# EAGLE design Fan Controller v1.0 (EAGLE 6.4)
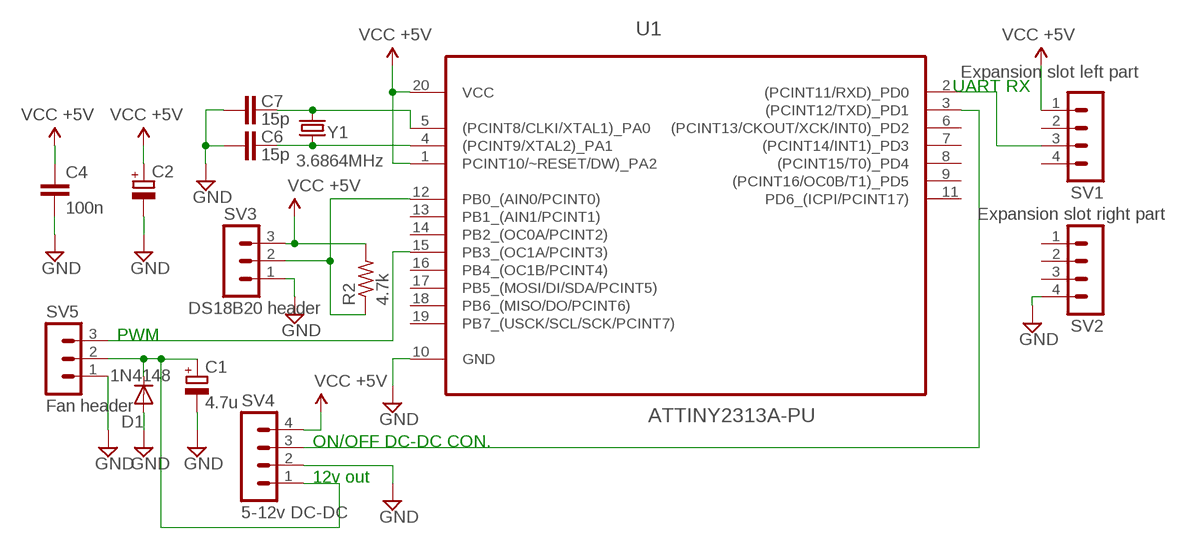
[diagram p0: schematic, sheet 1]

## Parts
C1  4.7u  CPOL-EUE2,5-6E  [E2,5-6E]
C2  CPOL-EUE5-6  [E5-6]
C4  100n  C-EUC0805K  [C0805K]
C6  15p  C-EUC0805K  [C0805K]
C7  15p  C-EUC0805K  [C0805K]
D1  1N4148  1N4148DO35-7  [DO35-7]
R2  4.7k  R-US_R1206  [R1206]
SV1  Expansion slot left part  MA04-1  [MA04-1]
SV2  Expansion slot right part  MA04-1  [MA04-1]
SV3  DS18B20 header  MA03-1  [MA03-1]
SV4  5-12v DC-DC  MA04-1  [MA04-1]
SV5  Fan header  MA03-1  [MA03-1]
U1  ATTINY2313A-PU  [DIP254P762X533-20]
Y1  3.6864MHz  CRYSTALHC49UV  [HC49U-V]

## Nets
12VOUT: C1.+ D1.C SV4.1 SV5.2
GND: C1.- C2.- C4.2 C6.2 C7.2 D1.A SV2.4 SV3.1 SV4.2 SV5.1 U1.10(GND)
N$1: SV1.3 U1.2((PCINT11/RXD)_PD0)
N$2: C7.1 U1.5((PCINT8/CLKI/XTAL1)_PA0) Y1.2
N$3: SV5.3 U1.15(PB3_(OC1A/PCINT3))
N$4: C6.1 U1.4((PCINT9/XTAL2)_PA1) Y1.1
N$5: R2.1 SV3.2 U1.12(PB0_(AIN0/PCINT0))
N$6: SV4.3 U1.3((PCINT12/TXD)_PD1)
VCC: C2.+ C4.1 R2.2 SV1.1 SV3.3 SV4.4 U1.1(PCINT10/~RESET/DW)_PA2) U1.20(VCC) ; supply symbol labelled VCC +5V
Unconnected: SV1.2 SV1.4 SV2.1 SV2.2 SV2.3 U1.6((PCINT13/CKOUT/XCK/INT0)_PD2) U1.7((PCINT14/INT1)_PD3) U1.8((PCINT15/T0)_PD4) U1.9((PCINT16/OC0B/T1)_PD5) U1.11(PD6_(ICPI/PCINT17)) U1.13(PB1_(AIN1/PCINT1)) U1.14(PB2_(OC0A/PCINT2)) U1.16(PB4_(OC1B/PCINT4)) U1.17(PB5_(MOSI/DI/SDA/PCINT5)) U1.18(PB6_(MISO/DO/PCINT6)) U1.19(PB7_(USCK/SCL/SCK/PCINT7))

## Notes on the sheet
- UART RX
- PWM
- ON/OFF DC-DC CON.
- 12v out

## Library data of the parts
C1 C2 = rcl:CPOL-EU: POLARIZED CAPACITOR, European symbol
C4 C6 C7 = rcl:C-EU: CAPACITOR, European symbol
D1 = diode:1N4148: DIODE high speed (Philips)
R2 = rcl:R-US_: RESISTOR, American symbol
SV1 SV2 SV4 = con-lstb:MA04-1: PIN HEADER; OC_FARNELL: unknown; OC_NEWARK: unknown
SV3 SV5 = con-lstb:MA03-1: PIN HEADER; OC_FARNELL: unknown; OC_NEWARK: unknown
U1 = Atmel_By_element14_Batch_1-00:ATTINY2313A-PU: 8-bit Microcontroller; DESCRIPTION: 8-bit Microcontroller; MPN: ATTINY2313A-PU; OC_FARNELL: 1841616; OC_NEWARK: 12T1333; PACKAGE: DIP-20; SUPPLIER: Atmel
Y1 = SteveMarple:CRYSTAL: Crystals Various standard crystals. Proven footprints. Spark Fun Electronics SKU : COM-00534

## Board
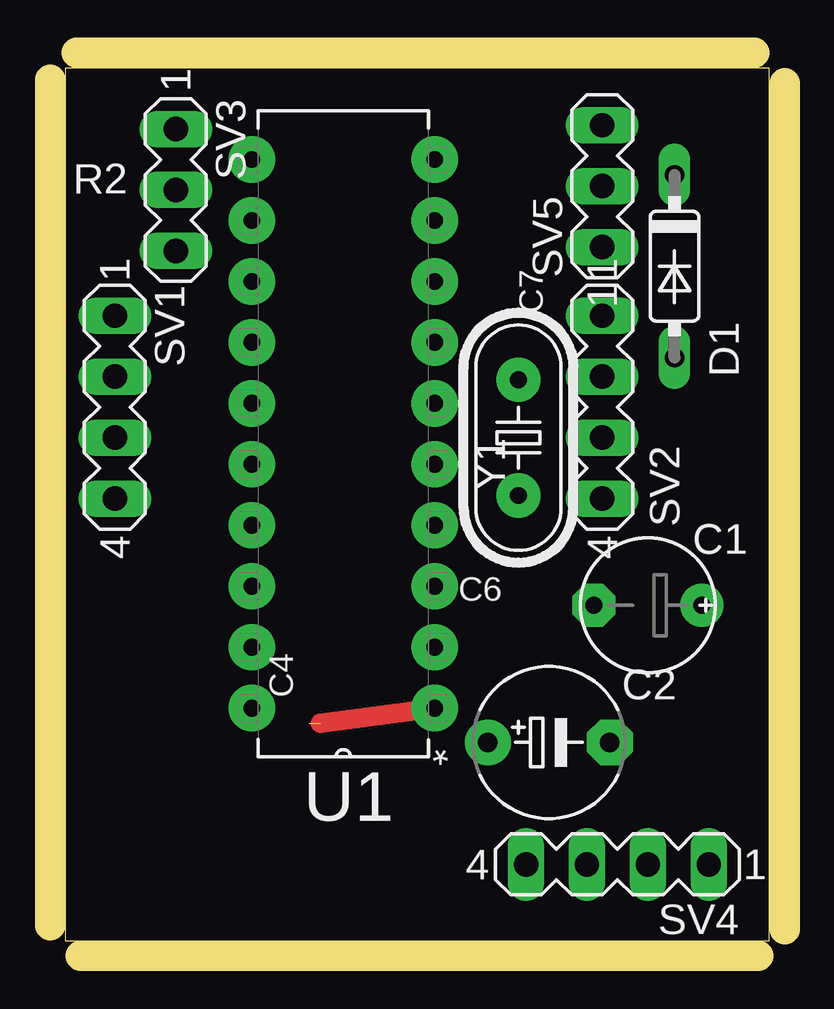
[diagram p1: board, top side]
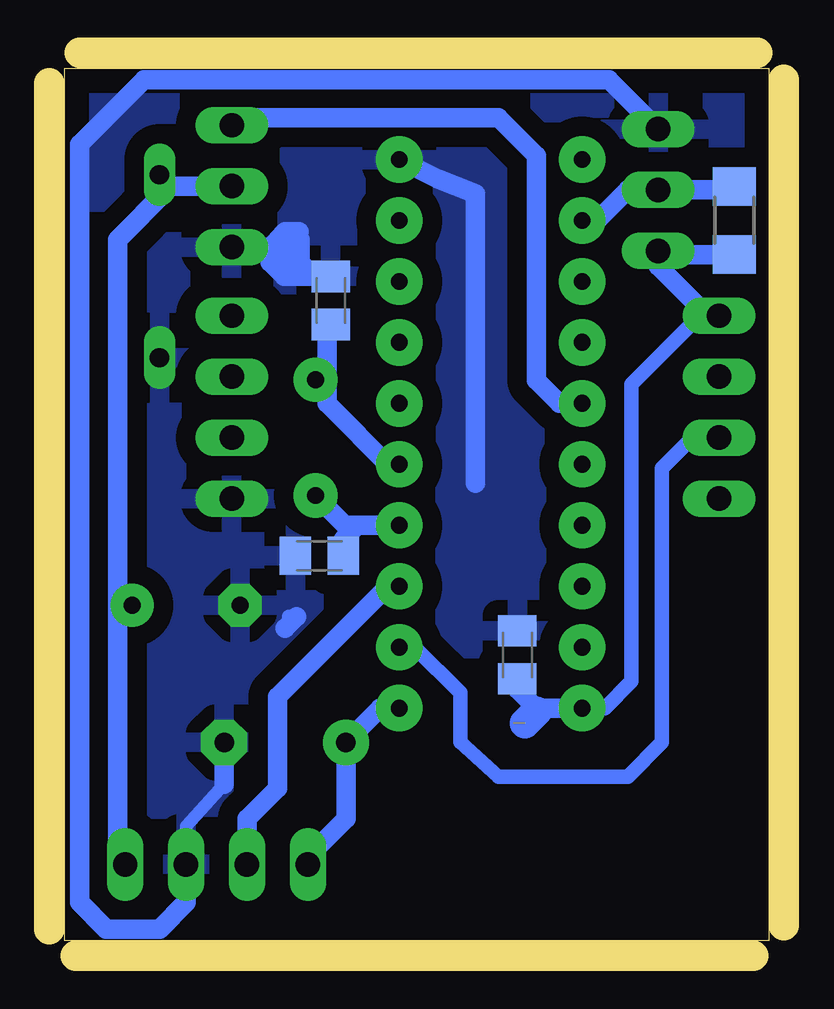
[diagram p2: board, bottom side, seen from below]

Size 29.35 x 36.34 mm. Coordinates in mm from the lower left corner, seen from the top.
Outline: 0,0 29.35,0 29.35,36.34 0,36.34 0,0
Copper layers (1*16): Top 0.035mm / dielectric 1.5mm / Bottom 0.035mm
Design rules "default *": minimum track width 10mil, minimum drill 24mil, track to track 8mil, track to pad 8mil, pad to pad 8mil, via to via 8mil, smd to smd 8mil, copper to edge 40mil, drill to drill 8mil, minimum pad ring 10mil, minimum via ring 8mil, stop-mask expansion 4mil, vias tented up to drill 0mil, thermal gap 25mil
Milling: 4 lines

### Footprints (pad centres in the part's own frame; a part is rotated, then mirrored left to right if it is on the bottom)
E2,5-6E = drill 0.7 pad 1.778: + -2.25,0 | drill 0.7 pad 1.778 octagon: - 2.25,0
E5-6 = drill 0.813 pad 1.905: + -2.54,0 | drill 0.813 pad 1.905 octagon: - 2.54,0
C0805K = smd 1.3 x 1.6: 1 -1,0; 2 1,0
DO35-7 = drill 0.8 long: A 3.81,0; C -3.81,0
R1206 = smd 1.6 x 1.803: 1 -1.422,0; 2 1.422,0
MA04-1 = drill 1.016 long: 1 -3.81,0; 2 -1.27,0; 3 1.27,0; 4 3.81,0
MA03-1 = drill 1.016 long: 1 -2.54,0; 2 0,0; 3 2.54,0
DIP254P762X533-20 = drill 0.7 pad 1.93: 1 -7.62,22.86; 2 -7.62,20.32; 3 -7.62,17.78; 4 -7.62,15.24; 5 -7.62,12.7; 6 -7.62,10.16; 7 -7.62,7.62; 8 -7.62,5.08; 9 -7.62,2.54; 10 -7.62,0; 11 0,0; 12 0,2.54; 13 0,5.08; 14 0,7.62; 15 0,10.16; 16 0,12.7; 17 0,15.24; 18 0,17.78; 19 0,20.32; 20 0,22.86
HC49U-V = drill 0.7 pad 1.85: 1 -2.413,0; 2 2.413,0

### Placement (x,y rotation side)
C1  24.29,13.97 180 top
C2  20.16,8.26 0 top
C4  10.48,11.91 90 bottom
C6  18.73,16.03 180 bottom
C7  18.26,26.67 90 bottom
D1  25.4,28.1 270 top
R2  1.43,30 270 bottom
SV1  2.06,22.23 270 top
SV2  22.38,22.23 270 top
SV3  4.6,31.27 270 top
SV4  23.02,3.17 180 top
SV5  22.38,31.43 90 top
U1  7.78,32.54 180 top
Y1  18.89,20.95 90 top

### Tracks (layer width: path | path; a pad name or v marks a point on that pad's centre or on a via)
12VOUT
  Bottom 0.813: 27.15,13.97 27.15,29.21 25.08,31.27 | 27.15,13.97 27.15,3.49 SV4.1 | 22.34,31.48 SV5.2 24.92,31.43 25.08,31.27 | D1.C 25.4,31.59 25.08,31.27 | C1.+ 27.15,13.97
GND
  Bottom 0.515: SV4.2 24.29,4.76 22.7,6.51
  Bottom 0.61: 19.68,13.49 20,13.49
  Bottom 0.813: 12.22,19.05 12.22,31.11 13.81,31.75 U1.10 | SV5.1 20.8,28.89 20.48,29.21 | 20.48,29.21 20.16,29.53 19.57,29.53 | C7.2 20.21,27.67 20.8,28.26 19.53,28.26 | 19.53,28.26 19.21,27.94 | 19.53,28.26 20.16,28.89 | 20.48,29.21 19.53,29.21 19.53,28.26 | SV4.2 24.29,1.59 25.4,0.48 27.62,0.48 28.73,1.59 28.73,33.18 26.03,35.88 6.67,35.88 SV3.1 | 20.16,13.02 19.68,13.49 | 22.7,6.51 C2.-
  pour Bottom (isolate 0.813): -0.48,2.22 -0.48,35.72 28.73,35.72 28.73,2.54
N$1
  Bottom 0.61: SV1.3 3.17,20.95 4.44,19.68 4.44,8.26 5.87,6.83 11.27,6.83 12.86,8.26 12.86,10.32 14.76,12.22 U1.2
N$2
  Bottom 0.813: U1.5 15.72,19.68 18.41,22.38 18.41,23.84 | C7.1 18.41,25.51 18.41,23.84 | 18.41,23.84 Y1.2
N$3
  Bottom 0.813: SV5.3 22.07,34.29 11.27,34.29 9.68,32.7 9.68,23.34 8.73,22.38 U1.15
N$4
  Bottom 0.813: U1.4 17.14,17.3 | 17.14,17.3 17.65,17.3 Y1.1 | C6.1 17.73,16.72 17.14,17.3
N$5
  Bottom 0.813: 1.74,31.11 R2.1 1.58,31.27 SV3.2 5.87,31.27 7.14,30 U1.12
N$6
  Bottom 0.813: U1.3 15.4,14.61 16.03,14.61 20.48,10.16 20.48,6.35 21.75,5.08 SV4.3
VCC  (1 unrouted)
  Top 0.813: U1.1 10.64,9.05
  Bottom 0.61: 2.7,26.19 5.71,23.18 5.71,10.79 6.83,9.68 U1.20
  Bottom 0.813: R2.2 4.45,28.58 SV3.3 4.6,28.1 2.7,26.19 2.54,26.04 SV1.1 | SV4.4 19.21,3.49 17.62,5.08 C2.+ 16.19,9.68 U1.1 | U1.20 9.68,9.68 | C4.1 10.48,10.48 9.68,9.68 | 9.68,9.53 9.68,9.68
  Bottom 1.27: 9.68,9.53 10.16,9.05